# EasyEDA schematic LcsNodes-Extension-4x4-Occ-Detect-B.02.00.json

## Sheets
1 Sensor-Array-2
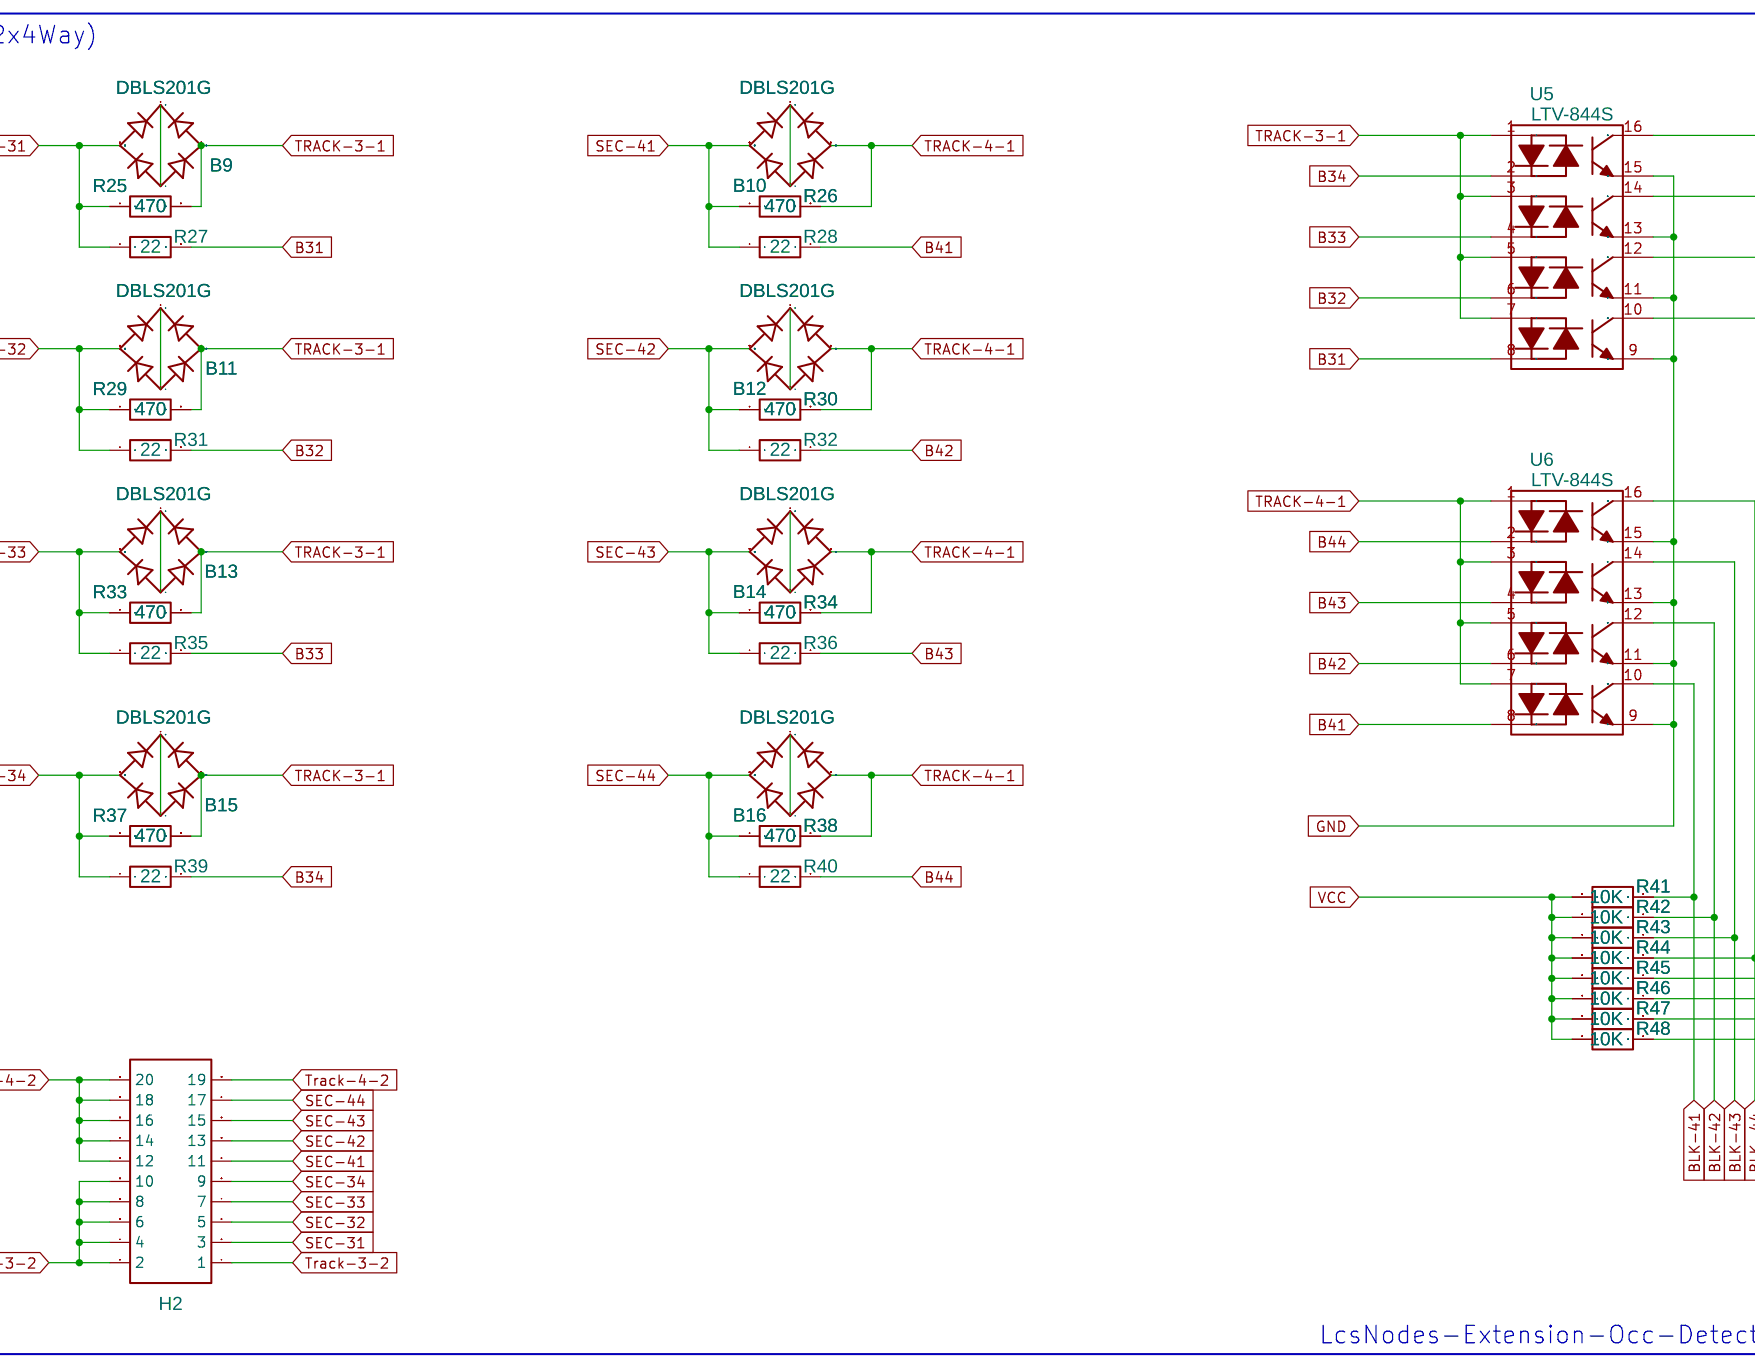
[diagram p0: Sensor-Array-2]
2 Connector-and-Logic
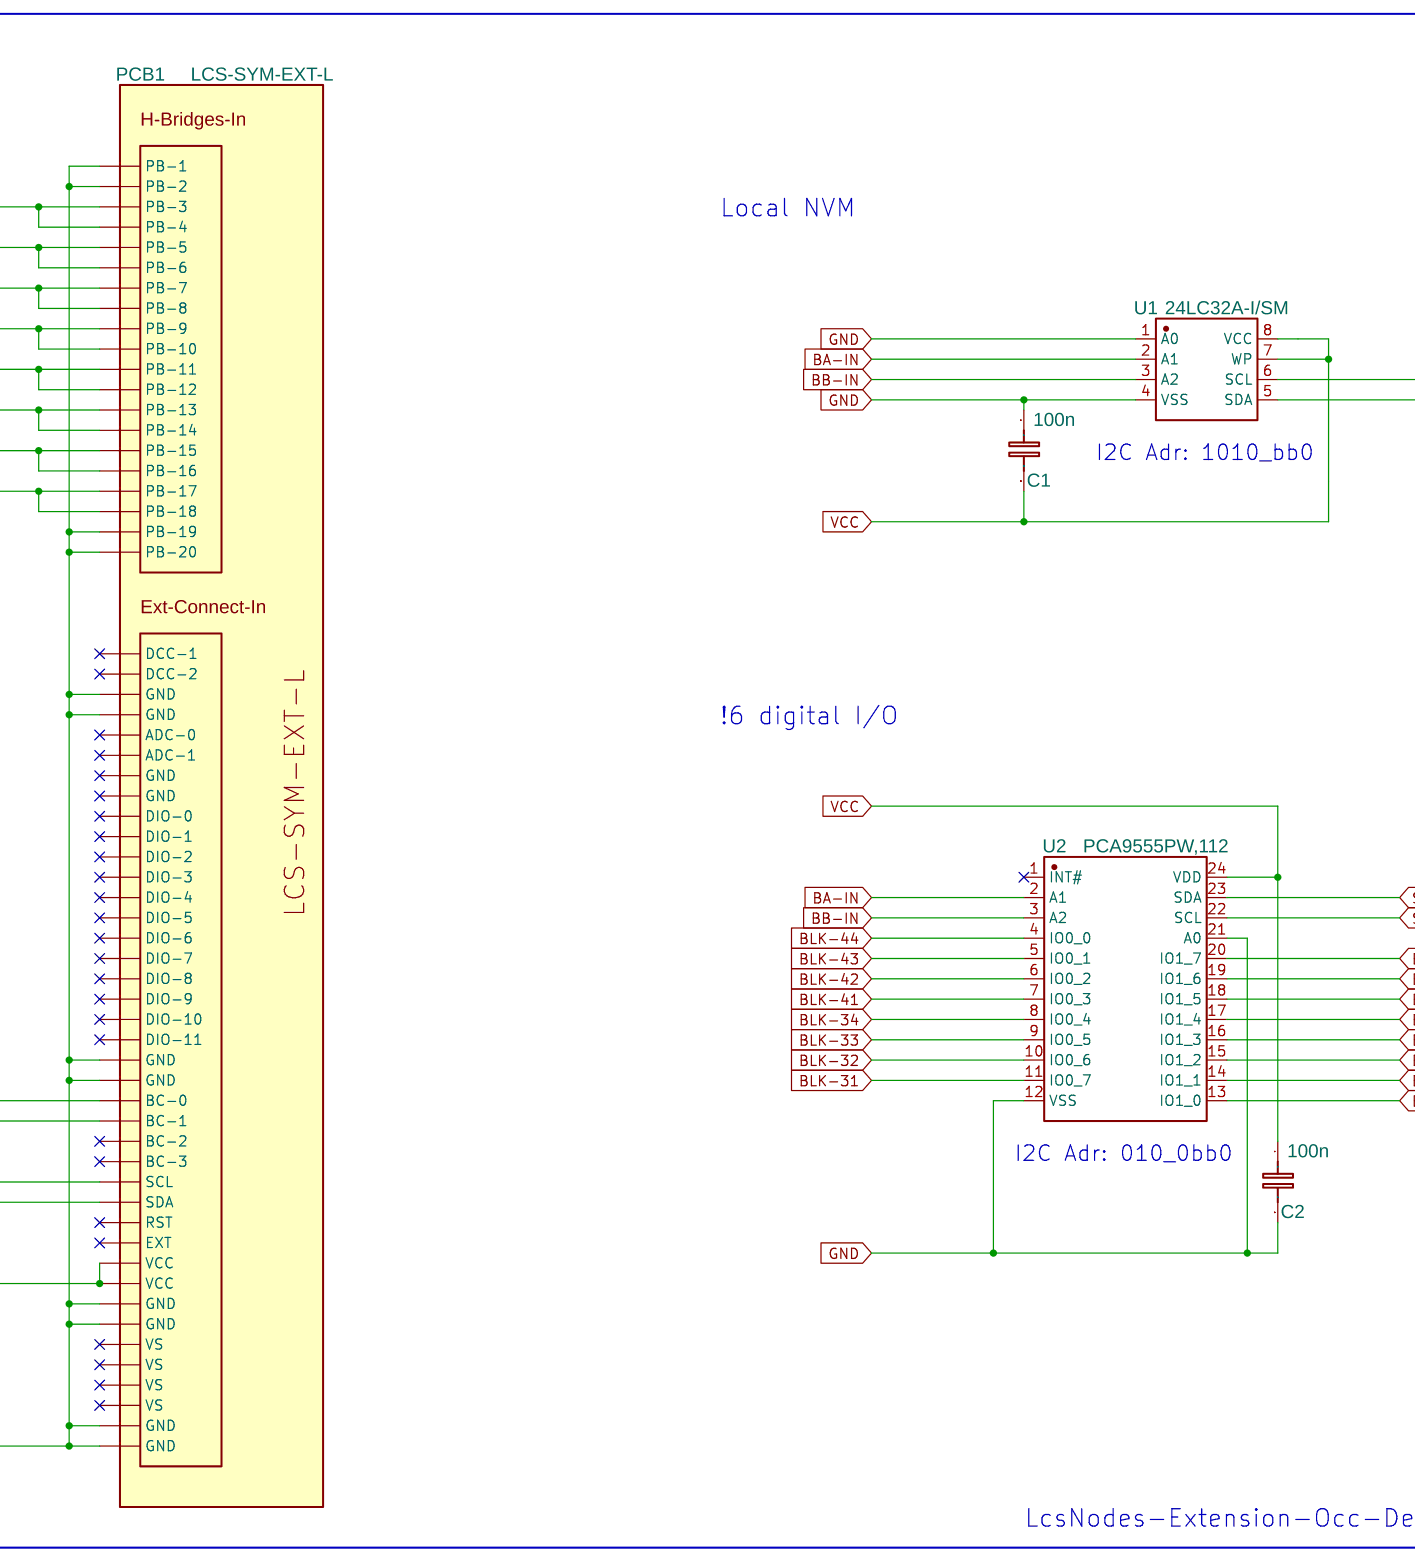
[diagram p1: Connector-and-Logic]
3 Sensor-Array-1
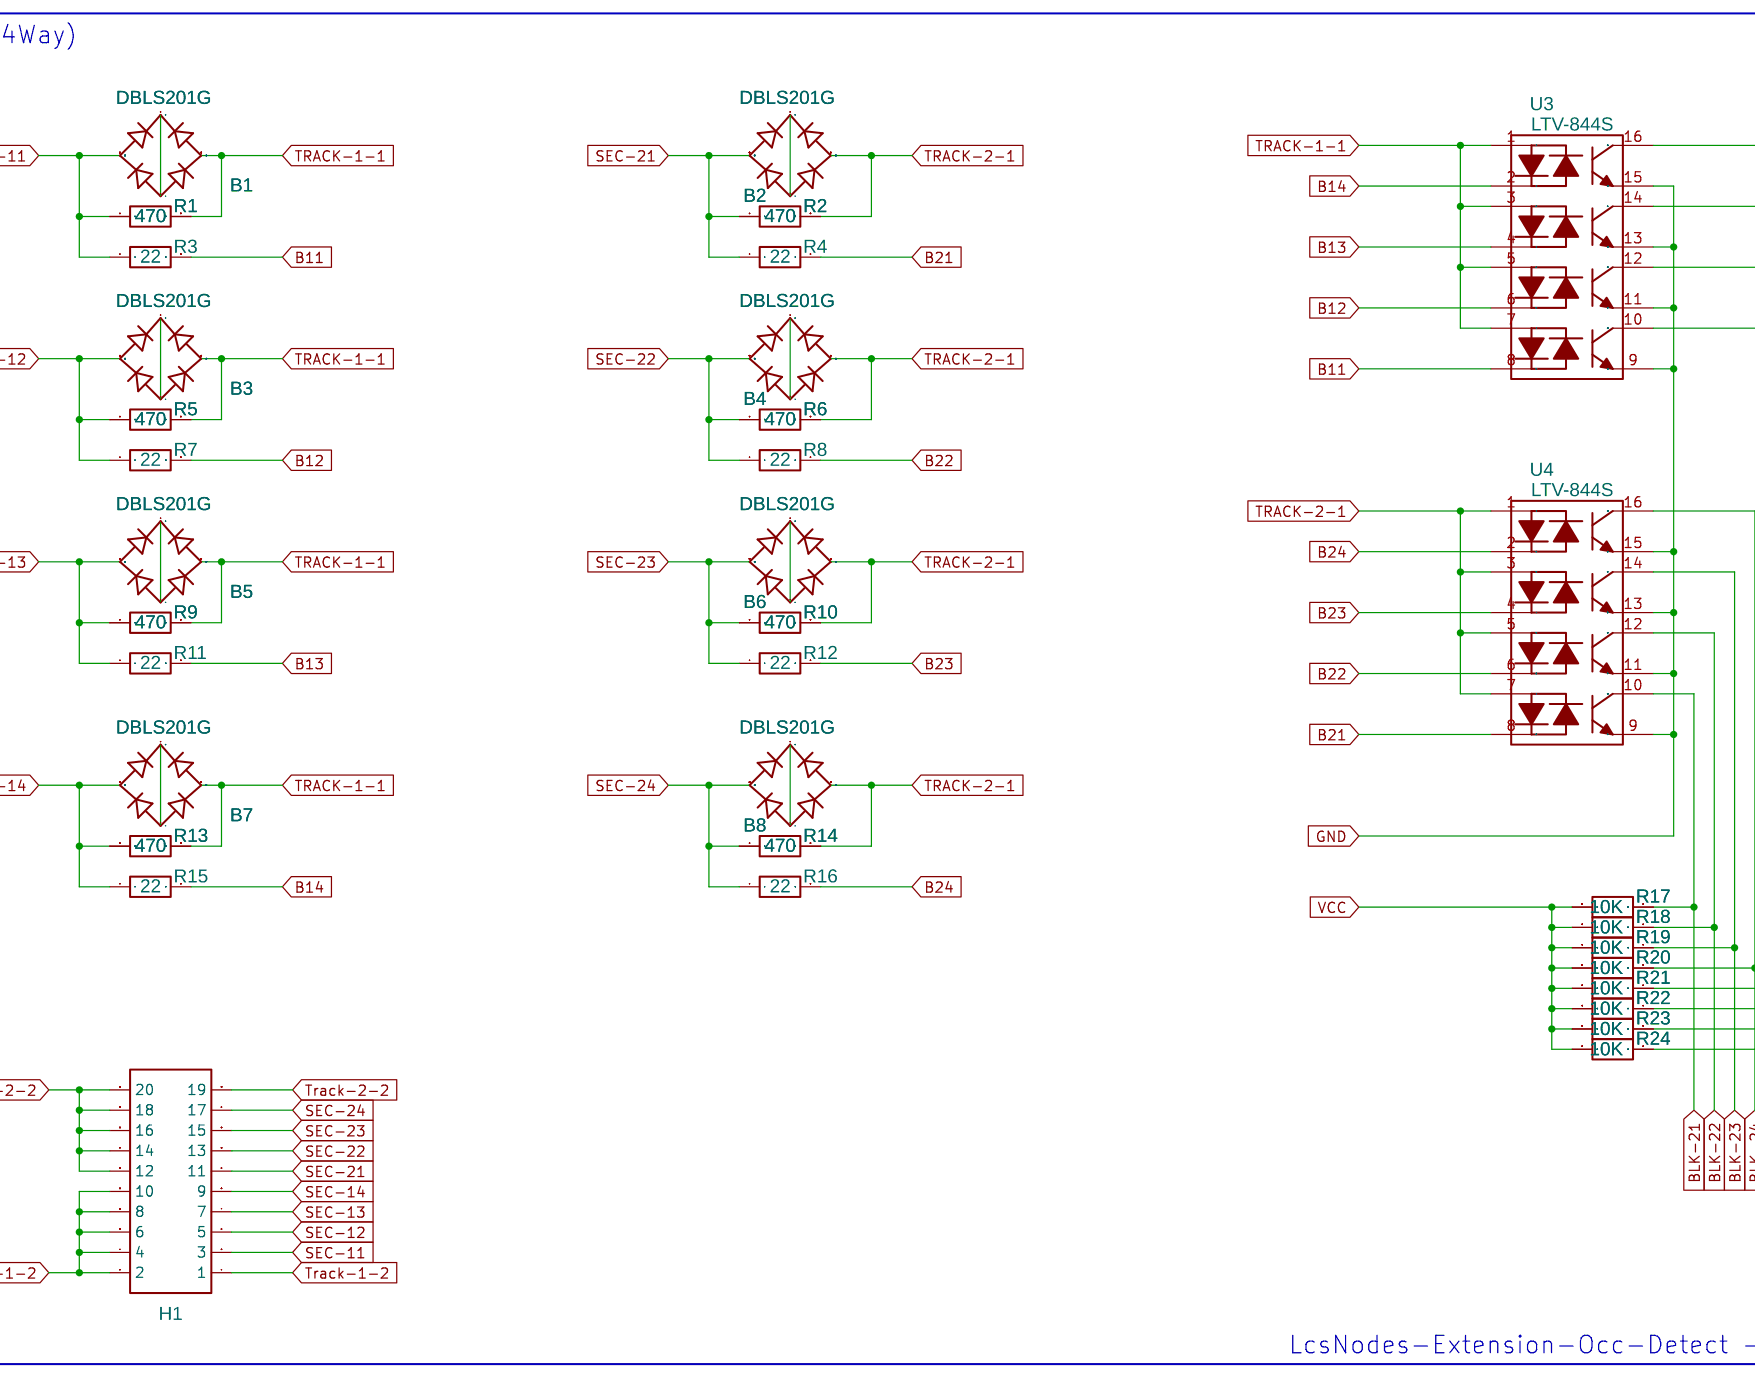
[diagram p2: Sensor-Array-1]
4 High Level Schematic

## Parts
sheet Connector-and-Logic
C1  100n  [C1206]
C2  100n  [C1206]
PCB1  LCS-SYM-EXT-L  [LCS-FP-EXT-L-10X12]
U1  24LC32A-I/SM  [SOIC-8_L4.9-W3.9-P1.27-LS6.0-BL]
U2  PCA9555PW,112  [TSSOP-24_L7.8-W4.4-P0.65-LS6.4-BL]
sheet Sensor-Array-1
B1  DBLS201G  [DBS]
B2  DBLS201G  [DBS]
B3  DBLS201G  [DBS]
B4  DBLS201G  [DBS]
B5  DBLS201G  [DBS]
B6  DBLS201G  [DBS]
B7  DBLS201G  [DBS]
B8  DBLS201G  [DBS]
H1  HDR-F-2.54_2x10  [HDR-F-2.54_2X10]
R1  470  [R1206]
R2  470  [R1206]
R3  22  [R1206]
R4  22  [R1206]
R5  470  [R1206]
R6  470  [R1206]
R7  22  [R1206]
R8  22  [R1206]
R9  470  [R1206]
R10  470  [R1206]
R11  22  [R1206]
R12  22  [R1206]
R13  470  [R1206]
R14  470  [R1206]
R15  22  [R1206]
R16  22  [R1206]
R17  10K  [R1206]
R18  10K  [R1206]
R19  10K  [R1206]
R20  10K  [R1206]
R21  10K  [R1206]
R22  10K  [R1206]
R23  10K  [R1206]
R24  10K  [R1206]
U3  LTV-844S  [OPTO-SMD-16_L19.8-W6.5-P2.54-LS10.2-BL]
U4  LTV-844S  [OPTO-SMD-16_L19.8-W6.5-P2.54-LS10.2-BL]
sheet Sensor-Array-2
B9  DBLS201G  [DBS]
B10  DBLS201G  [DBS]
B11  DBLS201G  [DBS]
B12  DBLS201G  [DBS]
B13  DBLS201G  [DBS]
B14  DBLS201G  [DBS]
B15  DBLS201G  [DBS]
B16  DBLS201G  [DBS]
H2  HDR-F-2.54_2x10  [HDR-F-2.54_2X10]
R25  470  [R1206]
R26  470  [R1206]
R27  22  [R1206]
R28  22  [R1206]
R29  470  [R1206]
R30  470  [R1206]
R31  22  [R1206]
R32  22  [R1206]
R33  470  [R1206]
R34  470  [R1206]
R35  22  [R1206]
R36  22  [R1206]
R37  470  [R1206]
R38  470  [R1206]
R39  22  [R1206]
R40  22  [R1206]
R41  10K  [R1206]
R42  10K  [R1206]
R43  10K  [R1206]
R44  10K  [R1206]
R45  10K  [R1206]
R46  10K  [R1206]
R47  10K  [R1206]
R48  10K  [R1206]
U5  LTV-844S  [OPTO-SMD-16_L19.8-W6.5-P2.54-LS10.2-BL]
U6  LTV-844S  [OPTO-SMD-16_L19.8-W6.5-P2.54-LS10.2-BL]

## Library data of the parts
C1 C2 = C_0603_EU: Contributor: LCEDA_Lib; Package Display: No
PCB1 = LCS-SYM-EXT-L: Contributor: helmut-f
U1 = 24LC32A-I/SM: Contributor: LCSC; Supplier: LCSC; Supplier Part: C616088; Manufacturer: MICROCHIP(美国微芯); JLCPCB Part Class: Extended Part
U2 = PCA9555PW,112: Supplier: LCSC; Supplier Part: C2688893; Manufacturer: NXP(恩智浦); Contributor: LCSC; JLCPCB Part Class: Extended Part
B1-B16 = DBLS201G: Single Phase 1.0 AMP Glass Passivated Bridge Rectifier
H1 H2 = HDR-F-2.54_2x10: Supplier Part: C30867; Supplier: LCSC; Contributor: LCEDA_Lib
R1-R48 = R_AXIAL-0.3_EU: Contributor: LCEDA_Lib
U3-U6 = LTV-844S: Supplier: LCSC; Supplier Part: C575506; Manufacturer: LITEON(台湾光宝); JLCPCB Part Class: Extended Part; Contributor: LCSC

## Nets
GND: C1.1 C2.2 PCB1.30(PB-1) PCB1.31(PB-2) PCB1.48(PB-19) PCB1.49(PB-20) PCB1.62(GND) PCB1.63(GND) PCB1.80(GND) PCB1.81(GND) PCB1.92(GND) PCB1.93(GND) PCB1.98(GND) PCB1.99(GND) U1.1(A0) U1.4(VSS) U2.12(VSS) U2.21(A0) U3.9 U3.11 U3.13 U3.15 U4.9 U4.11 U4.13 U4.15 U5.9 U5.11 U5.13 U5.15 U6.9 U6.11 U6.13 U6.15
VCC: C1.2 C2.1 PCB1.90(VCC) PCB1.91(VCC) R17.2 R18.2 R19.2 R20.2 R21.2 R22.2 R23.2 R24.2 R41.2 R42.2 R43.2 R44.2 R45.2 R46.2 R47.2 R48.2 U1.7(WP) U1.8(VCC) U2.24(VDD)
B11: R3.2 U3.8
B12: R7.2 U3.6
B13: R11.2 U3.4
B14: R15.2 U3.2
B21: R4.2 U4.8
B22: R8.2 U4.6
B23: R12.2 U4.4
B24: R16.2 U4.2
B31: R27.2 U5.8
B32: R31.2 U5.6
B33: R35.2 U5.4
B34: R39.2 U5.2
B41: R28.2 U6.8
B42: R32.2 U6.6
B43: R36.2 U6.4
B44: R40.2 U6.2
BA-IN: PCB1.82(BC-0) U1.2(A1) U2.2(A1)
BB-IN: PCB1.83(BC-1) U1.3(A2) U2.3(A2)
BLK-11: R21.1 U2.20(IO1_7) U3.10
BLK-12: R22.1 U2.19(IO1_6) U3.12
BLK-13: R23.1 U2.18(IO1_5) U3.14
BLK-14: R24.1 U2.17(IO1_4) U3.16
BLK-21: R17.1 U2.16(IO1_3) U4.10
BLK-22: R18.1 U2.15(IO1_2) U4.12
BLK-23: R19.1 U2.14(IO1_1) U4.14
BLK-24: R20.1 U2.13(IO1_0) U4.16
BLK-31: R45.1 U2.11(IO0_7) U5.10
BLK-32: R46.1 U2.10(IO0_6) U5.12
BLK-33: R47.1 U2.9(IO0_5) U5.14
BLK-34: R48.1 U2.8(IO0_4) U5.16
BLK-41: R41.1 U2.7(IO0_3) U6.10
BLK-42: R42.1 U2.6(IO0_2) U6.12
BLK-43: R43.1 U2.5(IO0_1) U6.14
BLK-44: R44.1 U2.4(IO0_0) U6.16
SCL: PCB1.86(SCL) U1.6(SCL) U2.22(SCL)
SDA: PCB1.87(SDA) U1.5(SDA) U2.23(SDA)
SEC-11: B1.AC1 H1.3 R1.1 R3.1
SEC-12: B3.AC1 H1.5 R5.1 R7.1
SEC-13: B5.AC1 H1.7 R9.1 R11.1
SEC-14: B7.AC1 H1.9 R13.1 R15.1
SEC-21: B2.AC2 H1.11 R2.1 R4.1
SEC-22: B4.AC2 H1.13 R6.1 R8.1
SEC-23: B6.AC2 H1.15 R10.1 R12.1
SEC-24: B8.AC2 H1.17 R14.1 R16.1
SEC-31: B9.AC1 H2.3 R25.1 R27.1
SEC-32: B11.AC1 H2.5 R29.1 R31.1
SEC-33: B13.AC1 H2.7 R33.1 R35.1
SEC-34: B15.AC1 H2.9 R37.1 R39.1
SEC-41: B10.AC2 H2.11 R26.1 R28.1
SEC-42: B12.AC2 H2.13 R30.1 R32.1
SEC-43: B14.AC2 H2.15 R34.1 R36.1
SEC-44: B16.AC2 H2.17 R38.1 R40.1
TRACK-1-1: B1.AC2 B3.AC2 B5.AC2 B7.AC2 PCB1.32(PB-3) PCB1.33(PB-4) R1.2 R5.2 R9.2 R13.2 U3.1 U3.3 U3.5 U3.7
TRACK-1-2: PCB1.34(PB-5) PCB1.35(PB-6)
Track-1-2: H1.1 H1.2 H1.4 H1.6 H1.8 H1.10
TRACK-2-1: B2.AC1 B4.AC1 B6.AC1 B8.AC1 PCB1.36(PB-7) PCB1.37(PB-8) R2.2 R6.2 R10.2 R14.2 U4.1 U4.3 U4.5 U4.7
TRACK-2-2: PCB1.38(PB-9) PCB1.39(PB-10)
Track-2-2: H1.12 H1.14 H1.16 H1.18 H1.19 H1.20
TRACK-3-1: B9.AC2 B11.AC2 B13.AC2 B15.AC2 PCB1.40(PB-11) PCB1.41(PB-12) R25.2 R29.2 R33.2 R37.2 U5.1 U5.3 U5.5 U5.7
Track-3-2: H2.1 H2.2 H2.4 H2.6 H2.8 H2.10
TRACK-3-2: PCB1.42(PB-13) PCB1.43(PB-14)
TRACK-4-1: B10.AC1 B12.AC1 B14.AC1 B16.AC1 PCB1.44(PB-15) PCB1.45(PB-16) R26.2 R30.2 R34.2 R38.2 U6.1 U6.3 U6.5 U6.7
Track-4-2: H2.12 H2.14 H2.16 H2.18 H2.19 H2.20
TRACK-4-2: PCB1.46(PB-17) PCB1.47(PB-18)
Net-(B1-+): B1.+ B1.-
Net-(B2-+): B2.+ B2.-
Net-(B3-+): B3.+ B3.-
Net-(B4-+): B4.+ B4.-
Net-(B5-+): B5.+ B5.-
Net-(B6-+): B6.+ B6.-
Net-(B7-+): B7.+ B7.-
Net-(B8-+): B8.+ B8.-
Net-(B9-+): B9.+ B9.-
Net-(B10-+): B10.+ B10.-
Net-(B11-+): B11.+ B11.-
Net-(B12-+): B12.+ B12.-
Net-(B13-+): B13.+ B13.-
Net-(B14-+): B14.+ B14.-
Net-(B15-+): B15.+ B15.-
Net-(B16-+): B16.+ B16.-

Not connected (* = marked no-connect by the designer): PCB1 19(DIO-1)* 60(DCC-1)* 61(DCC-2)* 64(ADC-0)* 65(ADC-1)* 66(GND)* 67(GND)* 68(DIO-0)* 70(DIO-2)* 71(DIO-3)* 72(DIO-4)* 73(DIO-5)* 74(DIO-6)* 75(DIO-7)* 76(DIO-8)* 77(DIO-9)* 78(DIO-10)* 79(DIO-11)* 84(BC-2)* 85(BC-3)* 88(RST)* 89(EXT)* 94(VS)* 95(VS)* 96(VS)* 97(VS)*; U2 1(INT#)*

## Notes on the sheets
sheet 1
- Track Sensor (2x4Way)
- LcsNodes-Extension-Occ-Detect - Sensors - Page 4 of 4
sheet 2
- Connector
- Local NVM
- I2C Adr: 1010_bb0
- !6 digital I/O
- I2C Adr: 010_0bb0
- LcsNodes-Extension-Occ-Detect - Connector, Logic - Page 2 of 4
sheet 3
- Track Sensor (2x4Way)
- LcsNodes-Extension-Occ-Detect - Sensors - Page 3 of 4
sheet 4
- Block 1
- 4 blocks with 4 sections each.
- Block 2
- Block 3
- Block 4
- Track Connector
- Opto
  Coupler
- Opto
  Coupler
- Diodes Array
  Block 3 and 4
- Diodes Array
  Block 1 and 2
- Track Connector
- Board NVM
- I2C Digital Input
- Extension Connector
- Board Select
- LcsNodes-Extension-Occ-Detect - Block Diagram - Page 1 of 4
